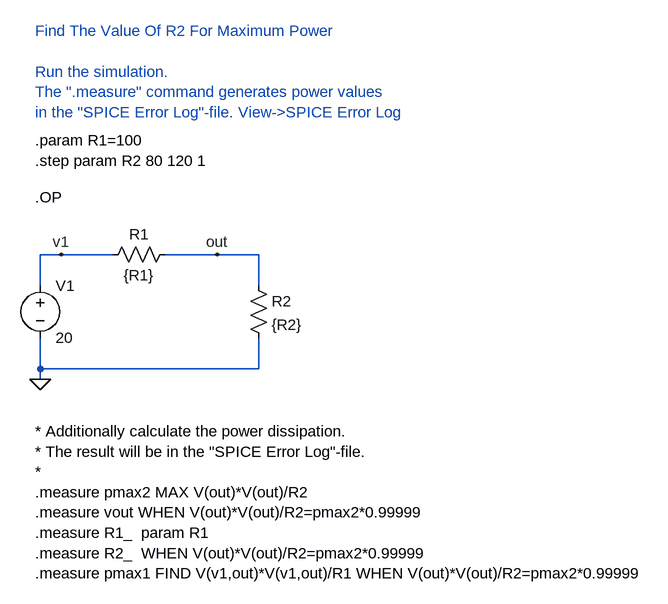
[diagram p0: schematic op_power2.asc]
op_power2.asc, the LTspice schematic file:
Version 4
SHEET 1 908 680
WIRE -112 112 -144 112
WIRE -32 112 -112 112
WIRE 128 112 48 112
WIRE 192 112 128 112
WIRE -144 160 -144 112
WIRE 192 160 192 112
WIRE -144 288 -144 240
WIRE 192 288 192 240
WIRE 192 288 -144 288
WIRE -144 304 -144 288
FLAG -144 304 0
FLAG 128 112 out
FLAG -112 112 v1
SYMBOL voltage -144 144 R0
SYMATTR InstName V1
SYMATTR Value 20
SYMBOL res -48 128 R270
WINDOW 0 32 56 VTop 0
WINDOW 3 0 56 VBottom 0
SYMATTR InstName R1
SYMATTR Value {R1}
SYMBOL res 176 144 R0
SYMATTR InstName R2
SYMATTR Value {R2}
TEXT -152 24 Left 0 !.OP
TEXT -152 384 Left 0 !* Additionally calculate the power dissipation.\n* The result will be in the "SPICE Error Log"-file.\n*\n.measure pmax2 MAX V(out)*V(out)/R2\n.measure vout WHEN V(out)*V(out)/R2=pmax2*0.99999\n.measure R1_  param R1\n.measure R2_  WHEN V(out)*V(out)/R2=pmax2*0.99999\n.measure pmax1 FIND V(v1,out)*V(v1,out)/R1 WHEN V(out)*V(out)/R2=pmax2*0.99999
TEXT -152 -232 Left 0 ;Find The Value Of R2 For Maximum Power\n \nRun the simulation.\nThe ".measure" command generates power values \nin the "SPICE Error Log"-file. View->SPICE Error Log
TEXT -152 -64 Left 0 !.param R1=100
TEXT -152 -32 Left 0 !.step param R2 80 120 1

The netlist it stands for:
* op_power2.asc
V1 v1 0 20
R1 v1 out {R1}
R2 out 0 {R2}
.OP
* Additionally calculate the power dissipation.
* The result will be in the "SPICE Error Log"-file.
*
.measure pmax2 MAX V(out)*V(out)/R2
.measure vout WHEN V(out)*V(out)/R2=pmax2*0.99999
.measure R1_  param R1
.measure R2_  WHEN V(out)*V(out)/R2=pmax2*0.99999
.measure pmax1 FIND V(v1,out)*V(v1,out)/R1 WHEN V(out)*V(out)/R2=pmax2*0.99999
* Find The Value Of R2 For Maximum Power
* Run the simulation.
* The ".measure" command generates power values
* in the "SPICE Error Log"-file. View->SPICE Error Log
.param R1=100
.step param R2 80 120 1
.backanno
.end